# EAGLE design i2c_sensor_and_led_hat (EAGLE 6.5.0)
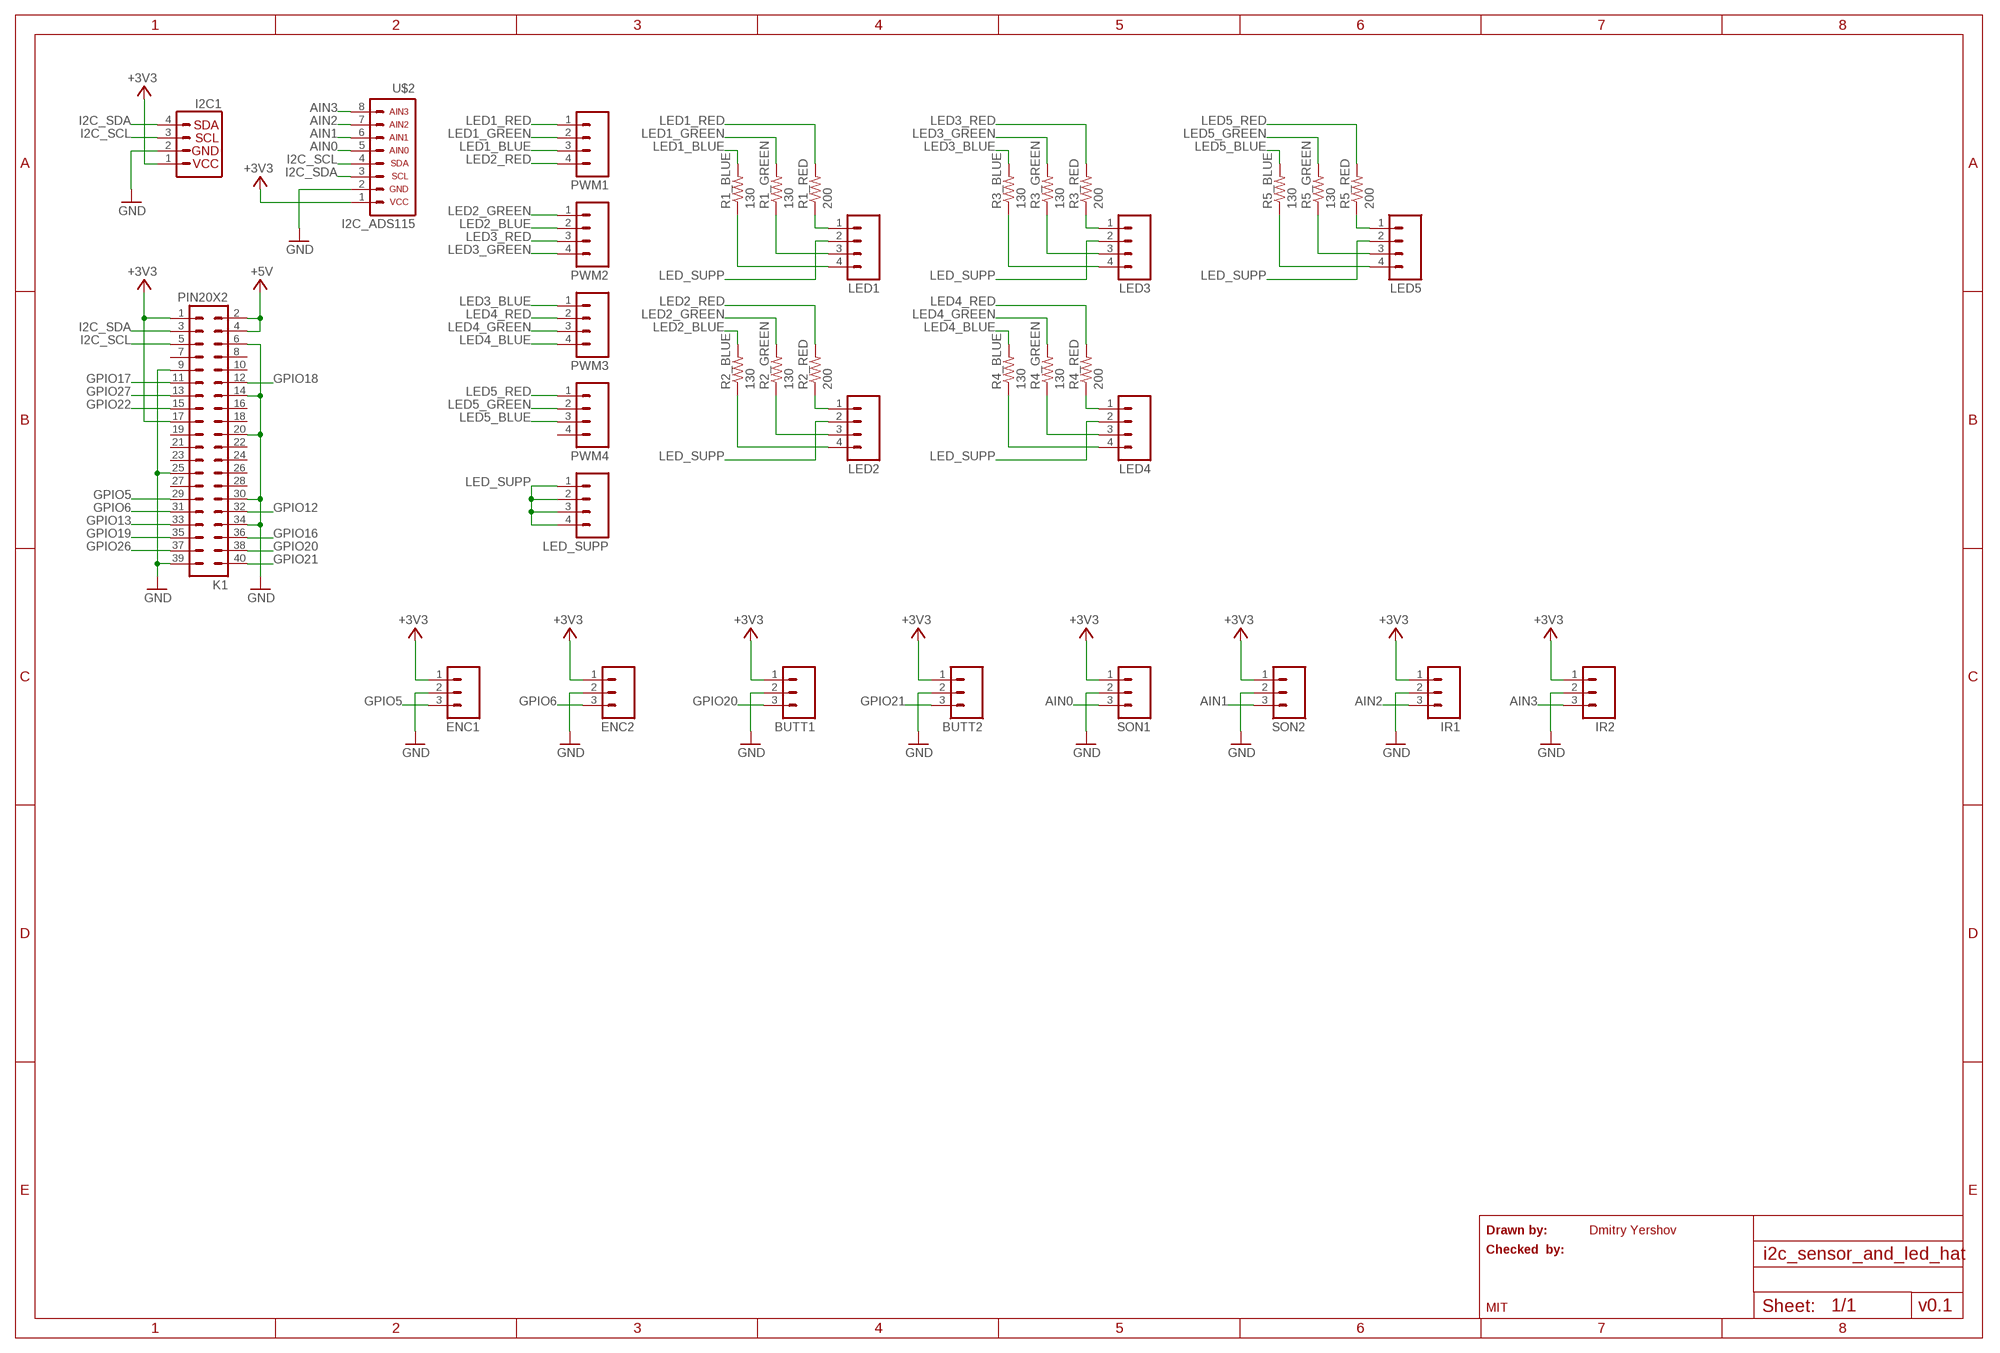
[diagram p0: schematic, sheet 1]

## Parts
BUTT1  M03PTH  [1X03]
BUTT2  M03PTH  [1X03]
ENC1  M03PTH  [1X03]
ENC2  M03PTH  [1X03]
I2C1  I2C_IMU_L3GD20H+LSM303  [1X04]
IR1  M03PTH  [1X03]
IR2  M03PTH  [1X03]
K1  PIN20X2  [PIN_20X2]
LED1  M04PTH  [1X04]
LED2  M04PTH  [1X04]
LED3  M04PTH  [1X04]
LED4  M04PTH  [1X04]
LED5  M04PTH  [1X04]
LED_SUPP  M041X04_NO_SILK  [1X04_NO_SILK]
PWM1  M041X04_NO_SILK  [1X04_NO_SILK]
PWM2  M041X04_NO_SILK  [1X04_NO_SILK]
PWM3  M041X04_NO_SILK  [1X04_NO_SILK]
PWM4  M041X04_NO_SILK  [1X04_NO_SILK]
R1_BLUE  130  R-US_0207/7  [0207/7]
R1_GREEN  130  R-US_0207/7  [0207/7]
R1_RED  200  R-US_0207/7  [0207/7]
R2_BLUE  130  R-US_0207/7  [0207/7]
R2_GREEN  130  R-US_0207/7  [0207/7]
R2_RED  200  R-US_0207/7  [0207/7]
R3_BLUE  130  R-US_0207/7  [0207/7]
R3_GREEN  130  R-US_0207/7  [0207/7]
R3_RED  200  R-US_0207/7  [0207/7]
R4_BLUE  130  R-US_0207/7  [0207/7]
R4_GREEN  130  R-US_0207/7  [0207/7]
R4_RED  200  R-US_0207/7  [0207/7]
R5_BLUE  130  R-US_0207/7  [0207/7]
R5_GREEN  130  R-US_0207/7  [0207/7]
R5_RED  200  R-US_0207/7  [0207/7]
SON1  M03PTH  [1X03]
SON2  M03PTH  [1X03]
U$2  I2C_ADS115  [I2C_AX4]

## Nets
+3V3: BUTT1.1 BUTT2.1 ENC1.1 ENC2.1 I2C1.1 IR1.1 IR2.1 K1.1 K1.17 SON1.1 SON2.1 U$2.1
+5V: K1.2 K1.4
AIN0: SON1.3 U$2.5
AIN1: SON2.3 U$2.6
AIN2: IR1.3 U$2.7
AIN3: IR2.3 U$2.8
GND: BUTT1.2 BUTT2.2 ENC1.2 ENC2.2 I2C1.2 IR1.2 IR2.2 K1.6 K1.9 K1.14 K1.20 K1.25 K1.30 K1.34 K1.39 SON1.2 SON2.2 U$2.2
GPIO5: ENC1.3 K1.29
GPIO6: ENC2.3 K1.31
GPIO12: K1.32
GPIO13: K1.33
GPIO16: K1.36
GPIO17: K1.11
GPIO18: K1.12
GPIO19: K1.35
GPIO20: BUTT1.3 K1.38
GPIO21: BUTT2.3 K1.40
GPIO22: K1.15
GPIO26: K1.37
GPIO27: K1.13
I2C_SCL: I2C1.3 K1.5 U$2.4
I2C_SDA: I2C1.4 K1.3 U$2.3
LED1_BLUE: PWM1.3 R1_BLUE.2
LED1_GREEN: PWM1.2 R1_GREEN.2
LED1_RED: PWM1.1 R1_RED.2
LED2_BLUE: PWM2.2 R2_BLUE.2
LED2_GREEN: PWM2.1 R2_GREEN.2
LED2_RED: PWM1.4 R2_RED.2
LED3_BLUE: PWM3.1 R3_BLUE.2
LED3_GREEN: PWM2.4 R3_GREEN.2
LED3_RED: PWM2.3 R3_RED.2
LED4_BLUE: PWM3.4 R4_BLUE.2
LED4_GREEN: PWM3.3 R4_GREEN.2
LED4_RED: PWM3.2 R4_RED.2
LED5_BLUE: PWM4.3 R5_BLUE.2
LED5_GREEN: PWM4.2 R5_GREEN.2
LED5_RED: PWM4.1 R5_RED.2
LED_SUPP: LED1.2 LED2.2 LED3.2 LED4.2 LED5.2 LED_SUPP.1 LED_SUPP.2 LED_SUPP.3 LED_SUPP.4
N$1: LED1.4 R1_BLUE.1
N$2: LED1.3 R1_GREEN.1
N$3: LED1.1 R1_RED.1
N$4: LED2.4 R2_BLUE.1
N$5: LED2.3 R2_GREEN.1
N$6: LED2.1 R2_RED.1
N$7: LED3.4 R3_BLUE.1
N$8: LED3.3 R3_GREEN.1
N$9: LED3.1 R3_RED.1
N$10: LED4.4 R4_BLUE.1
N$11: LED4.3 R4_GREEN.1
N$12: LED4.1 R4_RED.1
N$13: LED5.4 R5_BLUE.1
N$14: LED5.3 R5_GREEN.1
N$15: LED5.1 R5_RED.1
Unconnected: K1.7 K1.8 K1.10 K1.16 K1.18 K1.19 K1.21 K1.22 K1.23 K1.24 K1.26 K1.27 K1.28 PWM4.4

## Notes on the sheet
- Drawn by: | Dmitry Yershov
- Checked  by:
- MIT | v0.1

## Library data of the parts
BUTT1 BUTT2 ENC1 ENC2 IR1 IR2 SON1 SON2 = SparkFun-Connectors:M03: Header 3 Standard 3-pin 0.1" header. Use with straight break away headers (SKU : PRT-00116), right angle break away headers (PRT-00553), swiss pins (PRT-00743), machine pins (PRT-00117), and female headers (PRT-00115). Molex polarized connector foot print use with SKU : PRT-08232 with associated crimp pins and housings.
I2C1 = cambridge_garage_electronics:I2C_IMU_L3GD20H+LSM303: SparkFun has standardized on a pinout for all I2C based sensor breakouts. This pinout allows I2C boards to be plugged directly into the headers on Arduino Uno compatible boards, and to be daisy chained easily.
K1 = FLYFISH:PIN20X2
LED1-LED5 LED_SUPP PWM1-PWM4 = SparkFun-Connectors:M04: Header 4 Standard 4-pin 0.1" header. Use with straight break away headers (SKU : PRT-00116), right angle break away headers (PRT-00553), swiss pins (PRT-00743), machine pins (PRT-00117), and female headers (PRT-00115). Molex polarized connector foot print use with SKU : PRT-08231 with associated crimp pins and housings. 1MM SMD Version SKU: PRT-10208
R1_BLUE R1_GREEN R1_RED R2_BLUE R2_GREEN R2_RED R3_BLUE R3_GREEN R3_RED R4_BLUE R4_GREEN R4_RED R5_BLUE R5_GREEN R5_RED = adafruit:R-US_: RESISTOR, American symbol
U$2 = cambridge_garage_electronics:I2C_ADS1*15

## Board
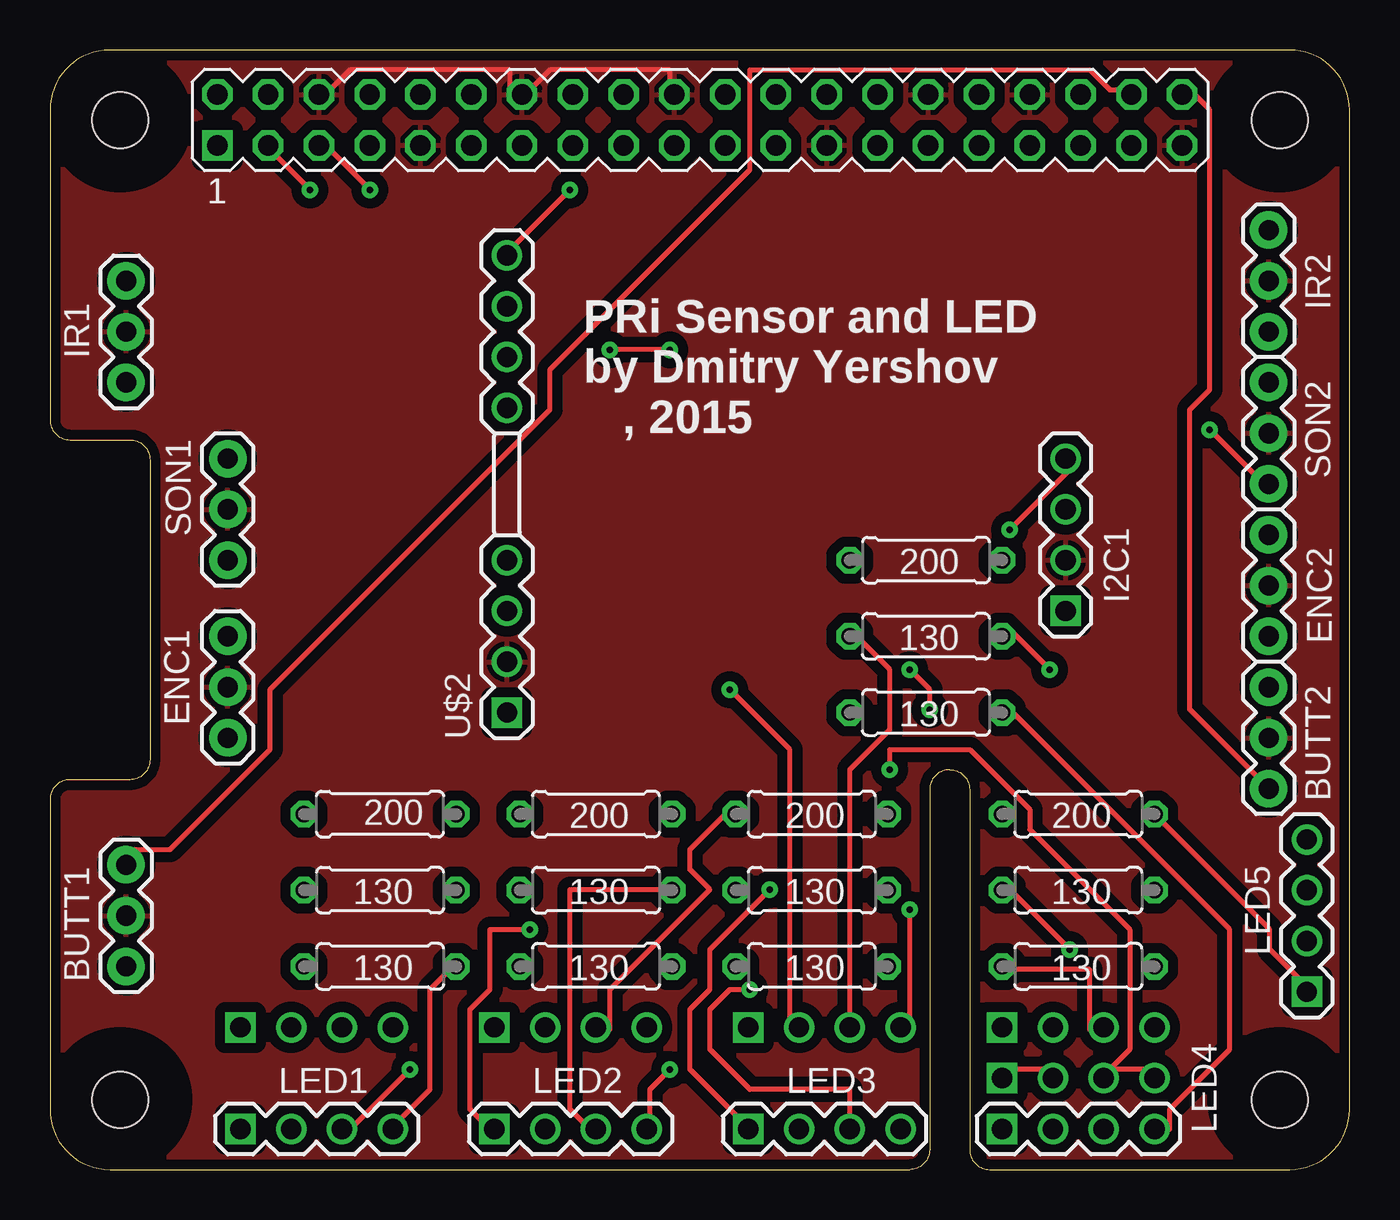
[diagram p1: board, top side]
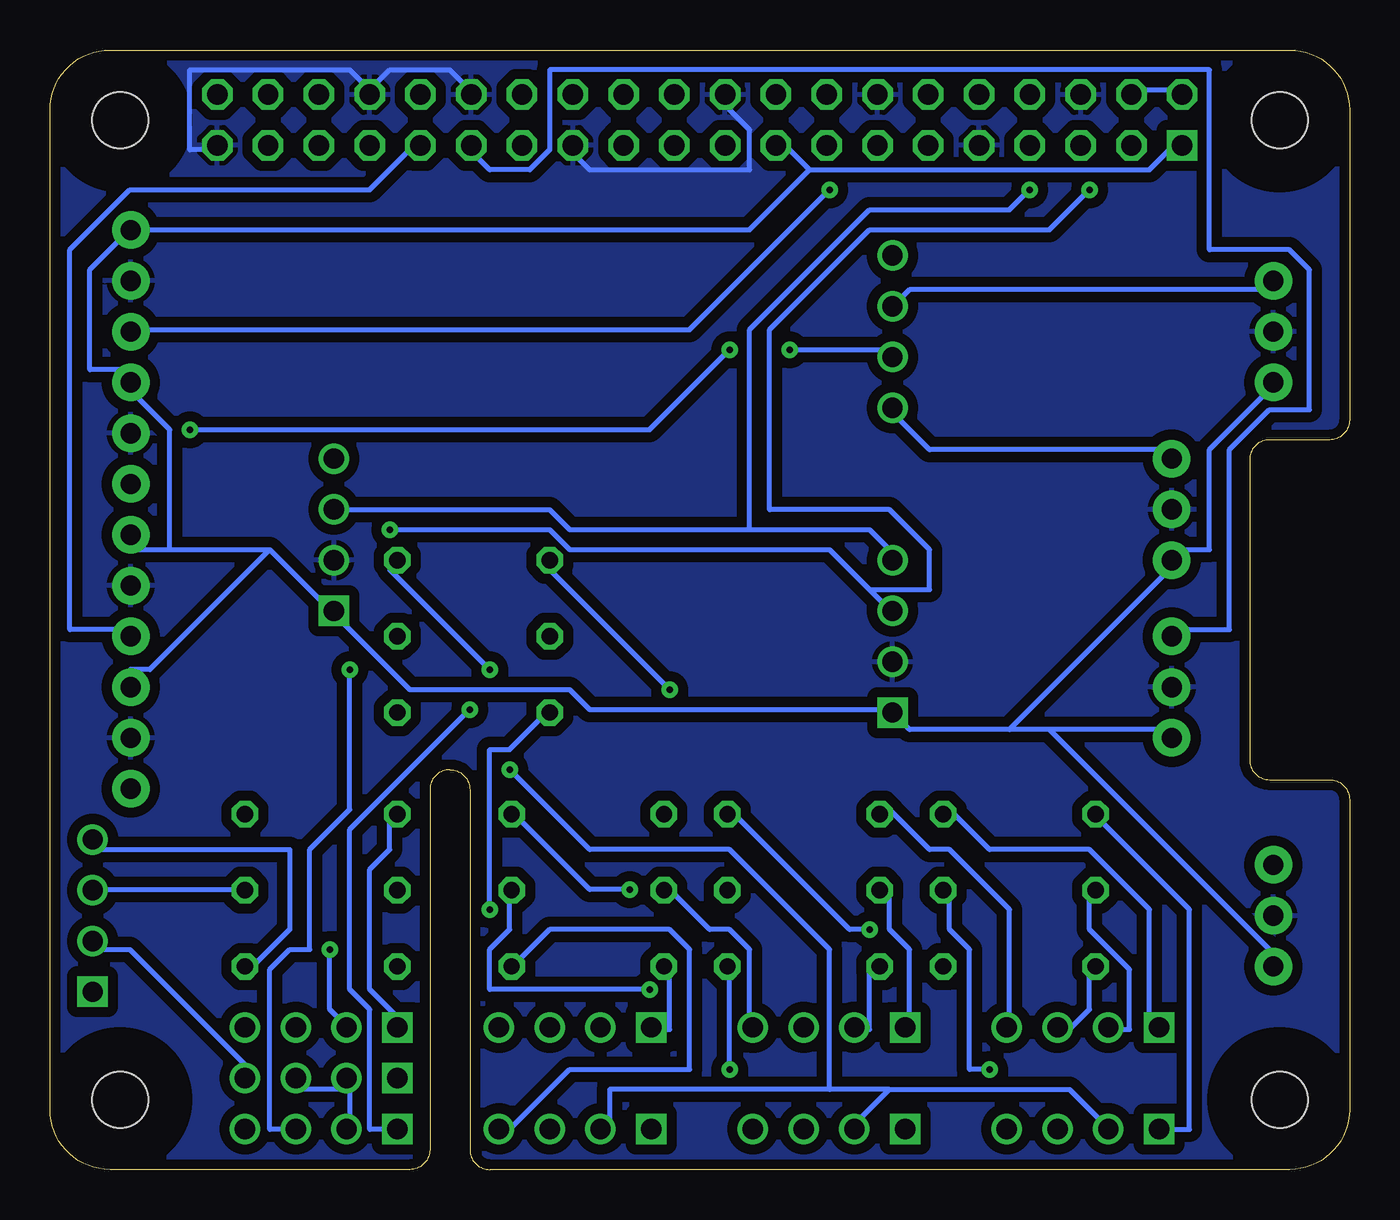
[diagram p2: board, bottom side, seen from below]

Size 65 x 56 mm. Coordinates in mm from the lower left corner, seen from the top.
Outline: 0,3 arc90 3,0 43,0 arc90 44,1 44,19 arc-90 45,20 arc-90 46,19 46,1 arc90 47,0 62,0 arc90 65,3 65,53 arc90 62,56 3,56 arc90 0,53 0,37.5 arc90 1,36.5 4,36.5 arc-90 5,35.5 5,20.5 arc-90 4,19.5 1,19.5 arc90 0,18.5 0,3
Copper layers (1*16): Top 0.035mm / dielectric 1.6mm / Bottom 0.035mm
Design rules "ITEADstudio_DRC *": minimum track width 10mil, minimum drill 12mil, track to track 10mil, track to pad 10mil, pad to pad 10mil, via to via 10mil, smd to smd 0mil, copper to edge 10mil, drill to drill 8mil, minimum pad ring 10mil, minimum via ring 10mil, stop-mask expansion 3mil, vias tented up to drill 12mil, thermal gap 10mil
Holes 2.8 mm at 3.5,3.5 3.5,52.5 61.5,52.5 61.5,3.5
tRestrict: area 1.9,51 to 5,54; area 60,51 to 63,54; area 60,1.9 to 63,5; area 1.9,1.9 to 5,5
bRestrict: area 1.9,1.9 to 5,5; area 1.9,51 to 5,54; area 60,1.9 to 63,5; area 60,51 to 63,54

### Footprints (pad centres in the part's own frame; a part is rotated, then mirrored left to right if it is on the bottom)
1X03 = drill 1.016 pad 1.88: 1 0,0; 2 2.54,0; 3 5.08,0
1X04 = drill 1.016 pad 1.524 square: 1 0,0 | drill 1.016 pad 1.524: 2 2.54,0; 3 5.08,0; 4 7.62,0
PIN_20X2 = drill 1.016 square: 1 -24.13,-1.27 | drill 1.016 octagon: 2 -24.13,1.27; 3 -21.59,-1.27; 4 -21.59,1.27; 5 -19.05,-1.27; 6 -19.05,1.27; 7 -16.51,-1.27; 8 -16.51,1.27; 9 -13.97,-1.27; 10 -13.97,1.27; 11 -11.43,-1.27; 12 -11.43,1.27; 13 -8.89,-1.27; 14 -8.89,1.27; 15 -6.35,-1.27; 16 -6.35,1.27; 17 -3.81,-1.27; 18 -3.81,1.27; 19 -1.27,-1.27; 20 -1.27,1.27; 21 1.27,-1.27; 22 1.27,1.27; 23 3.81,-1.27; 24 3.81,1.27; 25 6.35,-1.27; 26 6.35,1.27; 27 8.89,-1.27; 28 8.89,1.27; 29 11.43,-1.27; 30 11.43,1.27; 31 13.97,-1.27; 32 13.97,1.27; 33 16.51,-1.27; 34 16.51,1.27; 35 19.05,-1.27; 36 19.05,1.27; 37 21.59,-1.27; 38 21.59,1.27; 39 24.13,-1.27; 40 24.13,1.27
1X04_NO_SILK = drill 1.016 pad 1.524 square: 1 0,0 | drill 1.016 pad 1.524: 2 2.54,0; 3 5.08,0; 4 7.62,0
0207/7 = drill 0.813 octagon: 1 -3.81,0; 2 3.81,0
I2C_AX4 = drill 1.016 pad 1.524 square: 1 0,0 | drill 1.016 pad 1.524: 2 2.54,0; 3 5.08,0; 4 7.62,0; 5 15.24,0; 6 17.78,0; 7 20.32,0; 8 22.86,0

### Placement (x,y rotation side)
BUTT1  3.81,10.16 90 top
BUTT2  60.96,24.13 270 top
ENC1  8.89,21.59 90 top
ENC2  60.96,31.75 270 top
I2C1  50.8,27.94 90 top
IR1  3.81,39.37 90 top
IR2  60.96,46.99 270 top
K1  32.5,52.5 0 top
LED1  9.53,2.03 0 top
LED2  22.23,2.03 0 top
LED3  34.92,2.03 0 top
LED4  47.62,2.03 0 top
LED5  62.87,8.89 90 top
LED_SUPP  47.62,4.57 0 top
PWM1  9.53,7.11 0 top
PWM2  22.23,7.11 0 top
PWM3  34.92,7.11 0 top
PWM4  47.62,7.11 0 top
R1_BLUE  16.51,10.16 180 top
R1_GREEN  16.51,13.97 180 top
R1_RED  16.51,17.78 0 top
R2_BLUE  27.3,10.16 180 top
R2_GREEN  27.3,13.97 180 top
R2_RED  27.3,17.78 180 top
R3_BLUE  38.1,10.16 180 top
R3_GREEN  38.1,13.97 180 top
R3_RED  38.1,17.78 180 top
R4_BLUE  43.81,22.86 180 top
R4_GREEN  43.81,26.67 180 top
R4_RED  43.81,30.48 180 top
R5_BLUE  51.44,10.16 180 top
R5_GREEN  51.44,13.97 180 top
R5_RED  51.44,17.78 180 top
SON1  8.89,30.48 90 top
SON2  60.96,39.37 270 top
U$2  22.86,22.86 90 top

### Tracks (layer width: path | path; a pad name or v marks a point on that pad's centre or on a via)
+3V3
  Bottom 0.254: 15,22 9,22 ENC1.1 | 15,22 17,22 | 17,22 22,22 U$2.1 23,23 38,23 39,24 47,24 51,28 | 15,22 4,11 BUTT1.1 | 17,22 9,30 SON1.1 9,31 7,31 7,36 4,39 IR1.1 | 27,50 10,50 9,51 K1.1 | 27,50 28,51 K1.17 | 54,31 51,28 | 59,31 61,31 ENC2.1 | 59,31 54,31 | 54,31 60,25 61,25 BUTT2.1 | 59,31 59,37 61,39 SON2.1 61,40 63,40 63,45 61,47 | 27,50 30,47 61,47 | 61,47 IR2.1 | 51,28 I2C1.1
+5V
  Bottom 0.254: K1.2 9,54 11,54 K1.4
AIN0
  Bottom 0.254: U$2.5 23,38 21,36 9,36 SON1.3
AIN1  (via drill 0.3)
  Top 0.254: v31,41 v28,41 | v58,37 61,34 SON2.3
  Bottom 0.254: v28,41 23,41 U$2.6 | v31,41 35,37 v58,37
AIN2
  Bottom 0.254: U$2.7 23,43 22,44 4,44 IR1.3
AIN3  (via drill 0.3)
  Top 0.254: v26,49 23,46 U$2.8
  Bottom 0.254: v26,49 33,42 61,42 IR2.3
GND
  Top 0.254: K1.6 14,54 15,55 23,55 23,54 K1.14 24,54 25,55 31,55 31,54 K1.20
  Bottom 0.254: 49,54 48,55 45,55 44,54 K1.30 | K1.20 31,54 31,53 30,52 30,50 38,50 39,51 K1.25 | 49,54 50,55 58,55 58,51 57,51 K1.39 | 49,54 K1.34
  pour Top (isolate 0.508): 0,3 arc90 3,0 43,0 arc90 44,1 44,19 arc-90 45,20 arc-90 46,19 46,1 arc90 47,0 62,0 arc90 65,3 65,53 arc90 62,56 3,56 arc90 0,53 0,37.5 arc90 1,36.5 4,36.5 arc-90 5,35.5 5,20.5 arc-90 4,19.5 1,19.5 arc90 0,18.5
  pour Bottom (isolate 0.508): 0,3 arc90 3,0 43,0 arc90 44,1 44,19 arc-90 45,20 arc-90 46,19 46,1 arc90 47,0 62,0 arc90 65,3 65,53 arc90 62,56 3,56 arc90 0,53 0,37.5 arc90 1,36.5 4,36.5 arc-90 5,35.5 5,20.5 arc-90 4,19.5 1,19.5 arc90 0,18.5
GPIO5
  Bottom 0.254: K1.29 44,51 43,50 41,50 40,51 40,55 7,55 7,46 3,46 2,45 2,38 4,38 6,36 6,27 8,27 ENC1.3
GPIO6
  Bottom 0.254: K1.31 47,51 49,49 61,49 64,46 64,27 61,27 ENC2.3
GPIO20
  Top 0.254: K1.38 54,54 53,54 52,55 35,55 35,50 25,40 25,38 11,24 11,21 6,16 4,16 BUTT1.3
GPIO21
  Top 0.254: K1.40 57,54 58,53 58,39 57,38 57,23 61,19 BUTT2.3
I2C_SCL  (via drill 0.3)
  Top 0.254: v16,49 14,51 K1.5
  Bottom 0.254: 30,32 39,32 40,33 51,33 I2C1.3 | 30,32 24,32 23,31 U$2.4 | v16,49 17,48 24,48 30,42 30,32
I2C_SDA  (via drill 0.3)
  Top 0.254: v48,32 51,35 I2C1.4 | v13,49 11,51 K1.3
  Bottom 0.254: 24,29 26,31 39,31 40,32 v48,32 | 24,29 23,28 U$2.3 | v13,49 15,47 24,47 29,42 29,33 23,33 21,31 21,29 24,29
LED1_BLUE
  Bottom 0.254: R1_BLUE.2 13,10 13,8 14,7 PWM1.3
LED1_GREEN
  Bottom 0.254: R1_GREEN.2 13,14 13,12 11,10 11,7 12,7 PWM1.2
LED1_RED
  Bottom 0.254: R1_RED.2 20,18 18,16 13,16 10,13 10,7 PWM1.1
LED2_BLUE
  Bottom 0.254: R2_BLUE.2 24,10 24,7 25,7 PWM2.2
LED2_GREEN
  Bottom 0.254: R2_GREEN.2 23,14 23,12 22,11 22,7 PWM2.1
LED2_RED
  Bottom 0.254: R2_RED.2 23,18 21,16 20,16 17,13 17,7 PWM1.4
LED3_BLUE
  Bottom 0.254: R3_BLUE.2 34,10 34,7 35,7 PWM3.1
LED3_GREEN
  Bottom 0.254: R3_GREEN.2 34,14 32,12 31,12 30,11 30,7 PWM2.4
LED3_RED
  Top 0.254: R3_RED.2 34,18 32,16 32,15 33,14 28,9 28,7 PWM2.3
LED4_BLUE  (via drill 0.3)
  Top 0.254: v43,13 43,7 PWM3.4
  Bottom 0.254: v43,13 43,21 42,21 40,23 R4_BLUE.2
LED4_GREEN
  Top 0.254: R4_GREEN.2 40,27 42,25 42,22 40,20 40,7 PWM3.3
LED4_RED  (via drill 0.3)
  Top 0.254: v34,24 37,21 37,7 PWM3.2
  Bottom 0.254: v34,24 40,30 R4_RED.2
LED5_BLUE
  Top 0.254: R5_BLUE.2 48,10 52,10 52,7 PWM4.3
LED5_GREEN  (via drill 0.3)
  Top 0.254: v51,11 48,14 R5_GREEN.2
  Bottom 0.254: v51,11 51,8 50,7 PWM4.2
LED5_RED
  Bottom 0.254: R5_RED.2 48,18 48,16 49,15 49,9 47,7 PWM4.1
LED_SUPP  (via drill 0.3)
  Top 0.254: LED_SUPP.1 48,5 50,5 LED_SUPP.2 | 53,5 55,5 LED_SUPP.4 | 53,5 54,6 54,12 49,17 49,18 46,21 42,21 v42,20 | 53,5 LED_SUPP.3
  Bottom 0.254: 50,4 50,2 LED4.2 | 50,4 53,4 LED_SUPP.3 | 50,4 LED_SUPP.2 | LED_SUPP.4 55,5 61,11 63,11 LED5.2 | 23,4 14,4 12,2 LED1.2 | 23,4 25,2 LED2.2 | 23,4 26,4 | 26,4 37,4 37,2 LED3.2 | v42,20 38,16 31,16 26,11 26,4
N$1
  Top 0.254: R1_BLUE.1 20,10 19,9 19,4 17,2 LED1.4
N$2  (via drill 0.3)
  Top 0.254: v18,5 15,2 LED1.3
  Bottom 0.254: v18,5 19,5 19,11 20,12 20,14 R1_GREEN.1
N$3
  Bottom 0.254: R1_RED.1 13,18 8,13 8,2 9,2 LED1.1
N$4  (via drill 0.3)
  Top 0.254: v31,5 30,4 30,2 LED2.4
  Bottom 0.254: v31,5 31,10 R2_BLUE.1
N$5
  Top 0.254: R2_GREEN.1 31,14 26,14 26,3 27,2 LED2.3
N$6  (via drill 0.3)
  Top 0.254: v24,12 22,12 22,9 21,8 21,3 22,2 LED2.1
  Bottom 0.254: v24,12 25,12 31,18 R2_RED.1
N$7
  Bottom 0.254: R3_BLUE.1 42,10 40,12 34,12 33,11 33,5 39,5 42,2 LED3.4
N$8  (via drill 0.3)
  Top 0.254: v35,9 34,9 33,8 33,6 35,4 40,4 40,2 LED3.3
  Bottom 0.254: v35,9 43,9 43,11 42,12 42,14 R3_GREEN.1
N$9  (via drill 0.3)
  Top 0.254: v36,14 33,11 33,9 32,8 32,5 35,2 LED3.1
  Bottom 0.254: v36,14 38,14 42,18 R3_RED.1
N$10
  Top 0.254: R4_BLUE.1 48,23 59,12 59,6 56,3 56,2 LED4.4
N$11  (via drill 0.3)
  Top 0.254: v50,25 48,27 R4_GREEN.1
  Bottom 0.254: v50,25 50,18 52,16 52,11 53,11 54,10 54,2 53,2 LED4.3
N$12  (via drill 0.3)
  Top 0.254: v43,25 44,24 v44,23
  Bottom 0.254: v43,25 48,30 R4_RED.1 | v44,23 50,17 50,9 49,8 49,2 48,2 LED4.1
N$13
  Bottom 0.254: R5_BLUE.1 55,10 53,12 53,16 63,16 LED5.4
N$14
  Bottom 0.254: R5_GREEN.1 55,14 63,14 LED5.3
N$15
  Top 0.254: R5_RED.1 55,18 61,12 61,11 63,9 LED5.1

### Text on the board
tNames: PRi Sensor and LED / by Dmitry Yershov / , 2015
tValues: +3V | SIG | GND | GND | SIG | +3V | +3V | GND | SIG | SIG | GND | +3V | +3V | GND | SIG | SIG | GND | +3V | +3V | GND | SIG | SIG | GND | +3V
tStop: MIT